# EAGLE design GPS Dog Tracker (EAGLE 7.5.0)
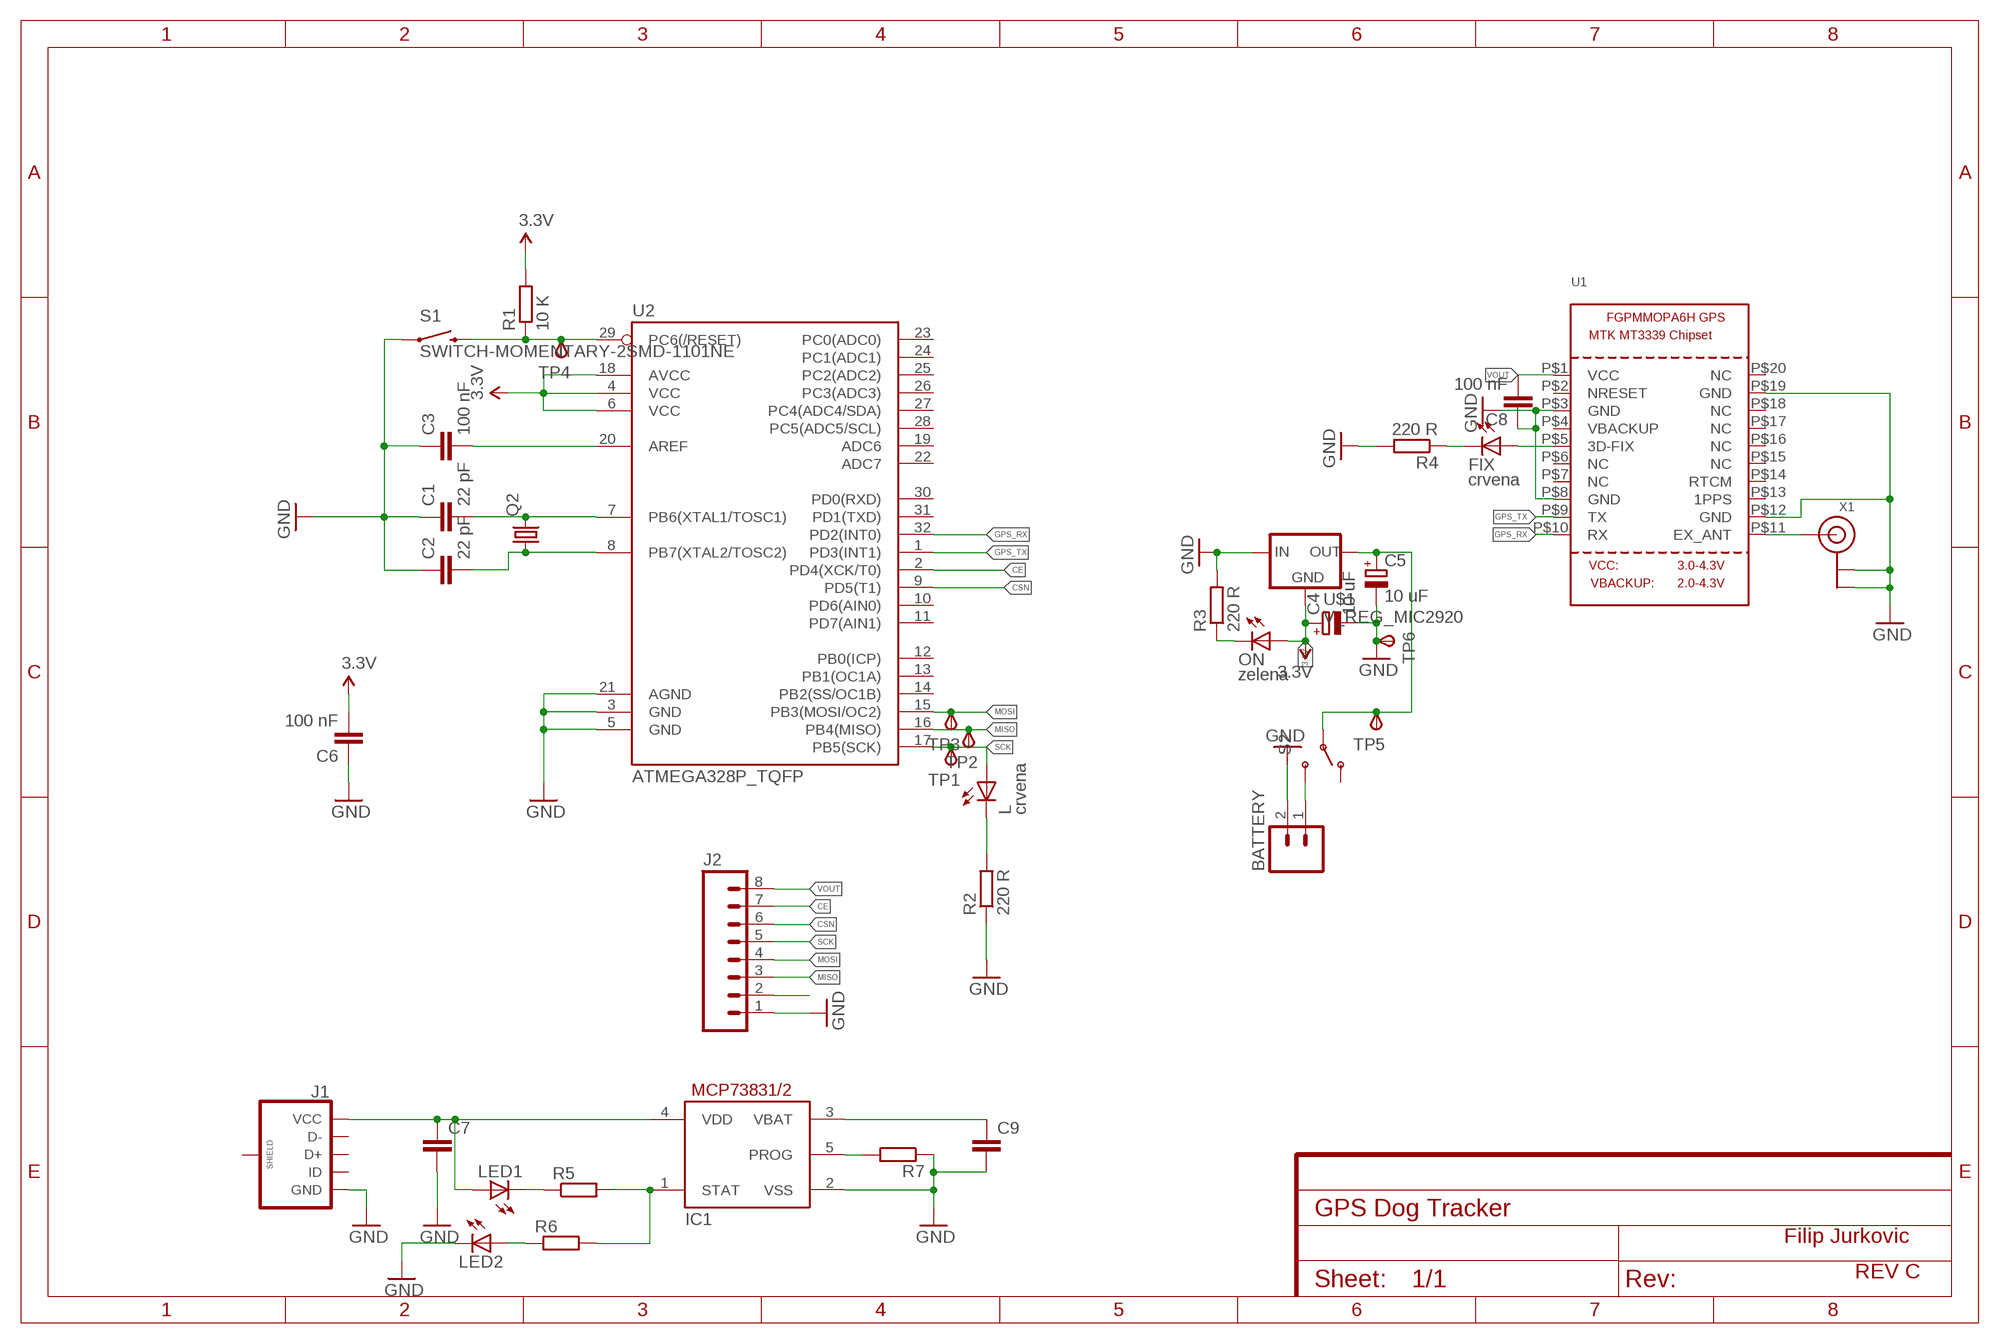
[diagram p0: schematic, sheet 1]

## Parts
BATTERY  M021X02_NO_SILK  [1X02_NO_SILK]
C1  22 pF  C-EUC0603  [C0603]
C2  22 pF  C-EUC0603  [C0603]
C3  100 nF  C-EUC0603  [C0603]
C4  10 uF  CPOL-EUSMCA  [SMC_A]
C5  10 uF  CPOL-EUSMCA  [SMC_A]
C6  100 nF  C-EUC0603  [C0603]
C7  C-EUC0603  [C0603]
C8  100 nF  C-EUC0603  [C0603]
C9  C-EUC0603  [C0603]
FIX  crvena  LEDCHIP-LED0805  [CHIP-LED0805]
IC1  MCP73831/OT  [SOT23-5L]
J1  USB_MICROB_PLUGCONN-11752  [USB-B-MICRO-SMD_V03]
J2  M08SILK_FEMALE_PTH  [1X08]
L  crvena  LEDCHIP-LED0805  [CHIP-LED0805]
LED1  LEDCHIPLED_0805  [CHIPLED_0805]
LED2  LEDCHIPLED_0805  [CHIPLED_0805]
ON  zelena  LEDCHIP-LED0805  [CHIP-LED0805]
Q2  CRYSTALHC49S  [HC49/S]
R1  10 K  R-EU_R0603  [R0603]
R2  220 R  R-EU_R0603  [R0603]
R3  220 R  R-EU_R0603  [R0603]
R4  220 R  R-EU_R0603  [R0603]
R5  R-EU_R0603  [R0603]
R6  R-EU_R0603  [R0603]
R7  R-EU_R0603  [R0603]
S1  SWITCH-MOMENTARY-2SMD-1101NE  [TACTILE-SWITCH-1101NE]
S2  SWITCH-SPDT-SMD-A  [SWITCH-SPST-SMD-A]
TP1  TPSTP13R  [TP13R]
TP2  TPSTP13R  [TP13R]
TP3  TPSTP13R  [TP13R]
TP4  TPSTP13R  [TP13R]
TP5  TPSTP13R  [TP13R]
TP6  TPSTP13R  [TP13R]
U1  GPS_FGPMMOPA6H  [FGPMMOPA6H]
U2  ATMEGA328P_TQFP  [TQFP32-08]
U$1  V_REG_MIC2920  [SOT223]
X1  ANTENNA_U.FL  [U.FL]

## Nets
3.3V: C4.+ C6.2 ON.A R1.2 U2.4(VCC) U2.6(VCC) U2.18(AVCC) U$1.2(GND)
CE: J2.7 U2.2(PD4(XCK/T0))
CSN: J2.6 U2.9(PD5(T1))
GND: BATTERY.2 C1.1 C2.1 C3.1 C4.- C5.- C6.1 C7.2 C8.1 C9.2 IC1.2(VSS) J1.GND J2.1 LED2.C R2.1 R3.2 R4.2 R7.1 S1.1 TP6.TP(PP) U1.P$3(GND) U1.P$8(GND) U1.P$12(GND) U1.P$19(GND) U2.3(GND) U2.5(GND) U2.21(AGND) U$1.1(IN) X1.1(GND) X1.2(GND)
GPS_RX: U1.P$10(RX) U2.32(PD2(INT0))
GPS_TX: U1.P$9(TX) U2.1(PD3(INT1))
MISO: J2.3 TP2.TP(PP) U2.16(PB4(MISO))
MOSI: J2.4 TP3.TP(PP) U2.15(PB3(MOSI/OC2))
N$1: C1.2 Q2.2 U2.7(PB6(XTAL1/TOSC1))
N$2: C2.2 Q2.1 U2.8(PB7(XTAL2/TOSC2))
N$3: C3.2 U2.20(AREF)
N$4: ON.C R3.1
N$5: FIX.A U1.P$5(3D-FIX)
N$6: FIX.C R4.1
N$7: J2.2
N$8: L.C R2.2
N$9: IC1.1(STAT) R5.2 R6.2
N$10: LED1.C R5.1
N$11: LED2.A R6.1
N$12: U1.P$11(EX_ANT) X1.3(SIGNAL)
N$13: IC1.5(PROG) R7.2
RESET: R1.1 S1.2 TP4.TP(PP) U2.29(PC6(/RESET))
SCK: J2.5 L.A TP1.TP(PP) U2.17(PB5(SCK))
VIN: BATTERY.1 C9.1 IC1.3(VBAT) S2.3(S)
VIN1: C5.+ C7.1 IC1.4(VDD) J1.VBUS(VCC) LED1.A S2.2(P) TP5.TP(PP) U$1.3(OUT)
VOUT: C8.2 J2.8 U1.P$1(VCC)
Unconnected: J1.D+ J1.D- J1.ID J1.SHIELD1(SHIELD) J1.SHIELD2(SHIELD) J1.SHIELD3(SHIELD) S2.1(O) U1.P$2(NRESET) U1.P$4(VBACKUP) U1.P$6(NC) U1.P$7(NC) U1.P$13(1PPS) U1.P$14(RTCM) U1.P$15(NC) U1.P$16(NC) U1.P$17(NC) U1.P$18(NC) U1.P$20(NC) U2.10(PD6(AIN0)) U2.11(PD7(AIN1)) U2.12(PB0(ICP)) U2.13(PB1(OC1A)) U2.14(PB2(SS/OC1B)) U2.19(ADC6) U2.22(ADC7) U2.23(PC0(ADC0)) U2.24(PC1(ADC1)) U2.25(PC2(ADC2)) U2.26(PC3(ADC3)) U2.27(PC4(ADC4/SDA)) U2.28(PC5(ADC5/SCL)) U2.30(PD0(RXD)) U2.31(PD1(TXD))

## Notes on the sheet
- Filip Jurkovic
- REV C

## Library data of the parts
BATTERY = SparkFun-Connectors:M02: Standard 2-pin 0.1" header. Use with - straight break away headers ( PRT-00116) - right angle break away headers (PRT-00553) - swiss pins (PRT-00743) - machine pins (PRT-00117) - female headers (PRT-00115) Molex polarized connector foot print use with: PRT-08233 with associated crimp pins and housings. 2.54_SCREWTERM for use with PRT-10571. 3.5mm Screw Terminal footprints for PRT-08084 5mm Screw Terminal footprints for use with PRT-08432
C1-C3 C6 C8 = rcl:C-EU: CAPACITOR, European symbol
C4 C5 = resistor:CPOL-EU: POLARIZED CAPACITOR, European symbol
C7 C9 = resistor:C-EU: CAPACITOR, European symbol
FIX L LED1 LED2 ON = adafruit:LED: LED OSRAM: - CHIPLED LG R971, LG N971, LY N971, LG Q971, LY Q971, LO R971, LY R971 LH N974, LH R974 LS Q976, LO Q976, LY Q976 LO Q996 - Hyper CHIPLED LW Q18S LB Q993, LB Q99A, LB R99A - SideLED LS A670, LO A670, LY A670, LG A670, LP A670 LB A673, LV A673, LT A673, LW A673 LH A674 LY A675 LS A676, LA A676, LO A676, LY A676, LW A676 LS A679, LY A679, LG A679 - Hyper Micro SIDELED® LS Y876, LA Y876, LO Y876, LY Y876 LT Y87S - SmartLED LW L88C, LW L88S LB L89C, LB L89S, LG L890 LS L89K, LO L89K, LY L89K LS L896, LA L896, LO L896, LY L896 - TOPLED LS T670, LO T670, LY T670, LG T670, LP T670 LSG T670, LSP T670, LSY T670, LOP T670, LYG T670 LG T671, LOG T671, LSG T671 LB T673, LV T673, LT T673, LW T673 LH T674 LS T676, LA T676, LO T676, LY T676, LB T676, LH T676, LSB T676, LW T676 LB T67C, LV T67C, LT T67C, LS T67K, LO T67K, LY T67K, LW E67C LS E67B, LA E67B, LO E67B, LY E67B, LB E67C, LV E67C, LT E67C LW T67C LS T679, LY T679, LG T679 LS T770, LO T770, LY T770, LG T770, LP T770 LB T773, LV T773, LT T773, LW T773 LH T774 LS E675, LA E675, LY E675, LS T675 LS T776, LA T776, LO T776, LY T776, LB T776 LHGB T686 LT T68C, LB T68C - Hyper Mini TOPLED® LB M676 - Mini TOPLED Santana® LG M470 LS M47K, LO M47K, LY M47K Source: http://www.osram.convergy.de/
IC1 = adafruit:MCP73831: MCP73831/2 Miniature Single-Cell, Fully Integrated Li-Ion, Li-Polymer Charge Management Controllers. Nice and small simple lipoly charge controller, with adjustable current and status output (LED) http://www.ladyada.net/library/pcb/eaglelibrary.html
J1 = SparkFun-Connectors:USB_MICROB_PLUG: USB Micro-B connectors Some male, some female. Watch your step!; PROD_ID: CONN-11752
J2 = SparkFun-Connectors:M08: Header 8 Standard 8-pin 0.1" header. Use with straight break away headers (SKU : PRT-00116), right angle break away headers (PRT-00553), swiss pins (PRT-00743), machine pins (PRT-00117), and female headers (PRT-00115).; PROD_ID: CONN-08438
Q2 = adafruit:CRYSTAL: CRYSTAL; OC_FARNELL: 1667008; OC_NEWARK: unknown
R1-R7 = rcl:R-EU_: RESISTOR, European symbol
S1 = SparkFun-Electromechanical:SWITCH-MOMENTARY-2: Various NO switches- pushbuttons, reed, etc; PROD_ID: SWCH-00815
S2 = SparkFun-Electromechanical:SWITCH-SPDT: SPDT Switch Simple slide switch, Spark Fun Electronics SKU : COM-00102 DPDT SMT slide switch, AYZ0202, SWCH-08179; PROD_ID: SWCH-10651
TP1-TP6 = testpad:TPS: TEST PIN
U1 = adafruit:GPS_FGPMMOPA6H: GPS Module - MTK MT3339 Chipset, -165dBm sensitivity, 22 channels, 10Hz, auto-select external antenna options
U2 = SparkFun-DigitalIC:ATMEGA328P_TQFP; PROD_ID: IC-09069
U$1 = SparkFun-PowerIC:V_REG_MIC2920: MIC2920A (http://www.micrel.com/_PDF/mic2920.pdf) - 400mA output LDO Regulator
X1 = adafruit:ANTENNA_U.FL: U.FL Antenna Connector

## Board
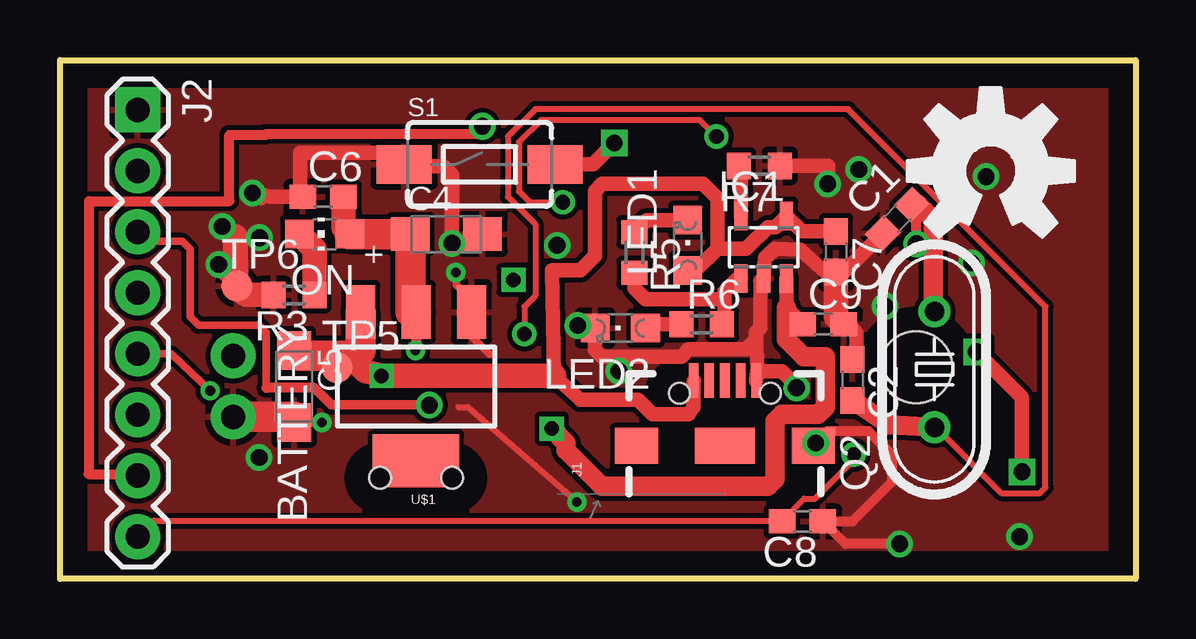
[diagram p1: board, top side]
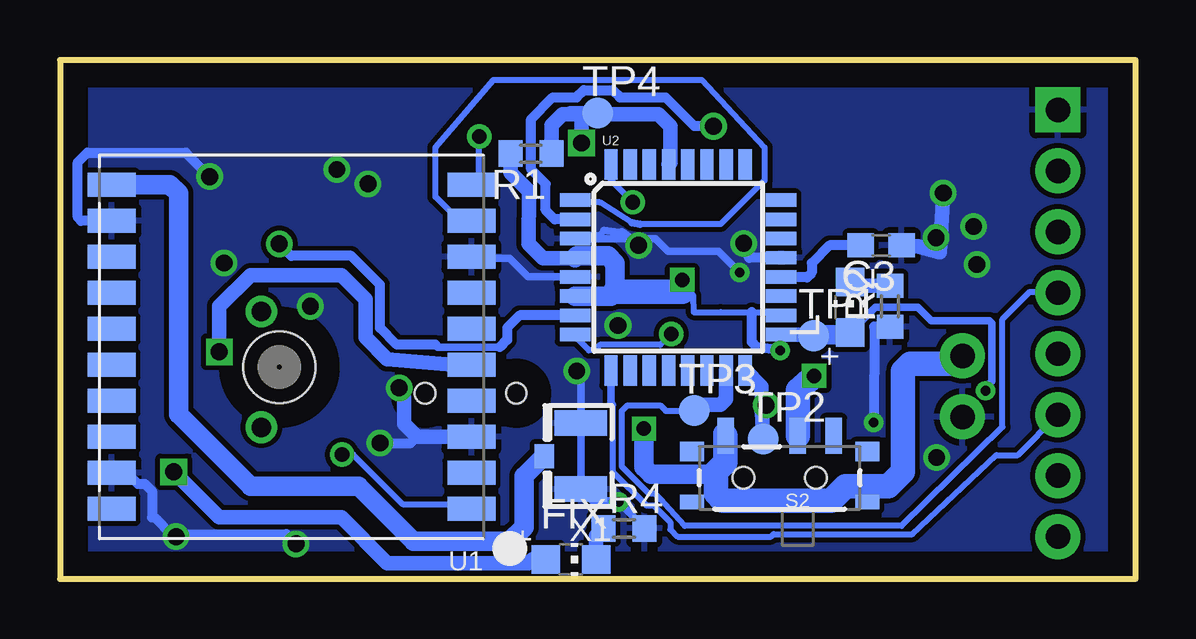
[diagram p2: board, bottom side, seen from below]

Size 44.84 x 21.62 mm. Coordinates in mm from the lower left corner, seen from the top.
Outline: 0,21.62 44.84,21.62 44.84,0 0,0 0,21.62
Copper layers (1*16): Top 0.035mm / dielectric 1.5mm / Bottom 0.035mm
Design rules "default": minimum track width 10mil, minimum drill 24mil, track to track 8mil, track to pad 8mil, pad to pad 8mil, via to via 8mil, smd to smd 8mil, copper to edge 40mil, drill to drill 8mil, minimum pad ring 10mil, minimum via ring 8mil, stop-mask expansion 4mil, vias tented up to drill 0mil, thermal gap 10mil

### Footprints (pad centres in the part's own frame; a part is rotated, then mirrored left to right if it is on the bottom)
1X02_NO_SILK = drill 1.016 pad 1.88: 1 0,0; 2 2.54,0
C0603 = smd 1.1 x 1: 1 -0.85,0; 2 0.85,0
SMC_A = smd 1.6 x 1.4: + -1.5,0; - 1.5,0
CHIP-LED0805 = smd 1.2 x 1.2: A 0,-1.05; C 0,1.05
SOT23-5L = smd 0.55 x 1.2: 1 -0.95,-1.3; 2 0,-1.3; 3 0.95,-1.3; 4 0.95,1.3; 5 -0.95,1.3
USB-B-MICRO-SMD_V03 = smd 1.45 x 0.4: D+ 2.725,0; D- 2.725,0.65; GND 2.725,-1.3; ID 2.725,-0.65; VBUS 2.725,1.3 | smd 1.5 x 1.8: SHIELD1 0,3.685; SHIELD2 0,-3.685 | smd 1.5 x 2.5: SHIELD3 0,0 | hole 0.85: 2.2,1.9; 2.2,-1.9
1X08 = drill 1.016 pad 1.88 square: 1 0,0 | drill 1.016 pad 1.88: 2 2.54,0; 3 5.08,0; 4 7.62,0; 5 10.16,0; 6 12.7,0; 7 15.24,0; 8 17.78,0
CHIPLED_0805 = smd 1.2 x 1.2: A 0,-1.05; C 0,1.05
HC49/S = drill 0.813: 1 -2.413,0; 2 2.413,0
R0603 = smd 1 x 1.1: 1 -0.85,0; 2 0.85,0
TACTILE-SWITCH-1101NE = smd 2.3 x 1.6: 1 -3.15,0; 2 3.15,0
SWITCH-SPST-SMD-A = smd 0.7 x 1.5: 1 -2.25,-1.75; 2 -0.75,-1.75; 3 2.25,-1.75 | smd 1 x 0.6: GND1 -3.65,1; GND3 3.65,1 | smd 1 x 0.8: GND2 -3.65,-1.1; GND4 3.65,-1.1 | hole 0.9: -1.5,0; 1.5,0
TP13R = smd 1.3 x 1.3: TP 0,0
FGPMMOPA6H = smd 2 x 1: P$1 -7.5,6.75; P$2 -7.5,5.25; P$3 -7.5,3.75; P$4 -7.5,2.25; P$5 -7.5,0.75; P$6 -7.5,-0.75; P$7 -7.5,-2.25; P$8 -7.5,-3.75; P$9 -7.5,-5.25; P$10 -7.5,-6.75; P$11 7.5,-6.75; P$12 7.5,-5.25; P$13 7.5,-3.75; P$14 7.5,-2.25; P$15 7.5,-0.75; P$16 7.5,0.75; P$17 7.5,2.25; P$18 7.5,3.75; P$19 7.5,5.25; P$20 7.5,6.75 | hole 3: 0.5,0.85
TQFP32-08 = smd 1.27 x 0.559: 1 -4.293,2.8; 2 -4.293,2; 3 -4.293,1.2; 4 -4.293,0.4; 5 -4.293,-0.4; 6 -4.293,-1.2; 7 -4.293,-2; 8 -4.293,-2.8; 17 4.293,-2.8; 18 4.293,-2; 19 4.293,-1.2; 20 4.293,-0.4; 21 4.293,0.4; 22 4.293,1.2; 23 4.293,2; 24 4.293,2.8 | smd 0.559 x 1.27: 9 -2.8,-4.293; 10 -2,-4.293; 11 -1.2,-4.293; 12 -0.4,-4.293; 13 0.4,-4.293; 14 1.2,-4.293; 15 2,-4.293; 16 2.8,-4.293; 25 2.8,4.293; 26 2,4.293; 27 1.2,4.293; 28 0.4,4.293; 29 -0.4,4.293; 30 -1.2,4.293; 31 -2,4.293; 32 -2.8,4.293
SOT223 = smd 1.219 x 2.235: 1 -2.311,-3.099; 2 0,-3.099; 3 2.311,-3.099 | smd 3.6 x 2.2: 4 0,3.099
U.FL = smd 2.2 x 1.05: 1 0,1.375; 2 0,-1.375 | smd 0.8 x 1: 3 1.525,0

### Placement (x,y rotation side)
BATTERY  7.22,9.29 270 top
C1  34.9,15 45 top
C2  33.04,8.29 270 top
C3  10.61,13.9 180 bottom
C4  16.11,14.37 0 top
C5  9.76,8.02 270 top
C6  10.97,15.92 0 top
C7  32.35,13.63 270 top
C8  30.95,2.4 180 top
C9  31.82,10.61 0 top
FIX  23.54,0.81 270 bottom
IC1  29.33,13.82 0 top
J1  27.72,5.54 90 top
J2  3.24,19.54 270 top
L  11.9,11.32 0 bottom
LED1  26.17,13.9 0 top
LED2  23.36,10.45 90 top
ON  11.03,14.37 90 top
Q2  36.45,8.73 90 top
R1  25.21,17.72 180 bottom
R2  10.24,11.36 90 bottom
R3  9.76,11.83 180 top
R4  21.33,2.1 0 bottom
R5  23.95,13.6 270 top
R6  26.75,10.61 0 top
R7  29.16,17.21 180 top
S1  17.49,17.27 0 top
S2  14.84,4.21 180 bottom
TP1  13.42,10.13 0 bottom
TP2  15.53,5.83 0 bottom
TP3  18.41,7.01 0 bottom
TP4  22.43,19.41 0 bottom
TP5  11.55,8.81 0 top
TP6  7.37,12.21 0 top
U1  35.19,9.67 180 bottom
U2  19.07,12.98 0 bottom
U$1  14.84,8.02 180 top
U$2  [OSHW-LOGO-L]  38.8,17 0 top
X1  23.13,5.12 180 bottom

### Tracks (layer width: path | path; a pad name or v marks a point on that pad's centre or on a via)
3.3V  (via drill 0.4, 0.6)
  Top 0.406: U$1.2 14.84,9.7 v14.82,9.52
  Top 1.016: C6.2 11.82,14.63 ON.A
  Top 1.27: ON.A C4.+ 14.61,11.12 U$1.2
  Bottom 0.254: U2.18 14.79,11.12 16,11.12 17.3,11.12 18.43,11.11 18.45,11.8 18.9,11.96
  Bottom 0.406: v14.82,9.52 15.8,9.66 16,9.86 16,11.12
  Bottom 0.61: R1.2 26.06,16.92 25.28,16.16 25.3,13.96 24.7,13.36 23.38,13.36 U2.4
  Bottom 0.813: U2.6 21.88,11.78 21.7,11.96 21.7,13.16 22,13.46 23.28,13.46 U2.4
  Bottom 1.016: 21.7,11.96 18.9,11.96 v18.9,12.46
CE  (via drill 0.7)
  Top 0.406: 17.4,18.66 v17.6,18.86 17.6,18.54 8.58,18.54 8.58,18.5 7.06,18.5 7.06,15.74 1.2,15.74 1.2,11.48 1.19,4.36 3.24,4.36 J2.7
  Bottom 0.406: U2.2 24.22,14.98 24.6,15.36 24.6,16.46 25.2,17.06 25.2,19.16 24.3,20.06 23.3,20.06 23,20.36 21.8,20.36 21.5,20.06 19.6,20.06 18.4,18.86 v17.6,18.86
CSN
  Bottom 0.254: 21.8,7.26 21.8,4.46 20.4,3.06 20.1,3.06 19.4,2.36 19.4,2.06 19.1,1.76 15.2,1.76 15.1,1.86 9.3,1.86 5.8,5.16 4.92,5.16 J2.6
  Bottom 0.305: U2.9 21.87,7.33 21.8,7.26
GND  (via drill 0.4, 0.7)
  Top 0.254: 16.6,7.16 17,7.16 v21.55,3.21
  Top 0.305: v23.3,8.66 23.3,9.16 23.2,9.26 | v16.5,12.76 16.5,12.26 17,11.76 17,10.26 17.9,9.36
  Top 0.406: v16.34,13.98 17,13.76 C4.- | v31.5,5.66 32,6.16 33.7,6.16 34.7,5.16 34.7,4.06 33.04,2.4 C8.1 32.74,1.46 v35,1.46 | LED2.C 21.61,10.45 v21.58,10.56 | 8.4,15.76 v8.02,16.08 | v10.92,6.52 9.76,6.5 C5.-
  Top 0.61: J1.GND 29.08,8.78 | 29.08,8.78 29.02,9.98 | 29.02,9.98 29.02,10.28 29.2,10.46 29.2,12.39 IC1.2 29.38,13.37 29.5,13.46 29.8,13.76 30.86,13.72 31.94,12.74 C7.2 32.68,12.78 C1.1 | 29.02,9.98 28.6,9.56 26.2,9.56 25.9,9.26 23.2,9.26 22.6,9.26 22.31,9.55 LED2.C | C9.2 32.85,10.61 33.2,10.26 33.2,9.3 C2.1 | v30.7,7.96 30.7,8.06 30.1,8.66 29.12,8.66 29.08,8.78 | v8.02,16.08 8.76,15.92 C6.1 10,15.92 10,17.76 14.34,17.76 S1.1 14.41,17.2 15.98,17.2 16.34,16.84 v16.34,13.98 | R7.1 32,17.21 v32,16.46 | 17,11.76 17,11.27 U$1.1 | v6.62,13.1 6.62,12.96 TP6.TP
  Top 1.016: C7.2 32.35,10.93 C9.2 | R3.2 7.73,11.83 7.3,12.26 7.3,14.28 TP6.TP
  Top 1.27: BATTERY.2 9.76,6.75 C5.-
  Bottom 0.254: U2.3 23.25,14.32 22.33,14.32 22.17,14.53 | v21.55,3.21 21.05,2.67 R4.2
  Bottom 0.305: R4.2 20.98,2.64 v21.55,3.21 21.2,3.26 22.64,3.26 X1.1 X1.2 23.13,8.49 v23.3,8.66 | 21.41,14.41 22.17,14.53 | U2.3 20.02,14.18 19.5,13.66 17.4,13.66 v16.5,12.76 | U2.5 25.32,12.58 26.1,13.36 27.63,13.36 U1.P$8
  Bottom 0.406: U2.21 16.12,13.38 v16.34,13.98 | v31.5,5.66 30.22,5.66 29.96,5.92 | 21.41,14.41 v20.72,13.9 | U1.P$19 42.06,4.42 41.6,3.96 41.3,3.96 41,3.66 41,2.56 40.9,2.56 40.2,1.86 35.4,1.86 v35,1.46 | U1.P$12 43.96,14.92 44.1,15.06 44.1,17.36 43.7,17.76 39.6,17.76 v38.6,16.76 | R2.1 10.9,10.51 v10.92,6.52
  Bottom 0.61: U1.P$3 29.96,5.92 30.5,6.46 30.5,7.56 v30.7,7.96 | v8.02,16.08 8.16,13.62 9.1,13.86 9.72,13.86 C3.1
  other vias: 8.3,5.06 33.3,17.06 38,13.16 34.4,11.36 6.76,14.68 8.32,14.22 40,1.76
  pour Bottom: 0.08,21.92 7.74,21.38 7.9,21.54 15.66,21.54 15.78,21.64 44.84,21.64 44.84,-0.02 5.98,-0.02 0.08,-0.06
  pour Top: 0,3.98 0,21.62 44.84,21.62 44.84,0 -0.02,0
GPS_RX  (via drill 0.61)
  Top 0.254: v20.96,15.69 19.59,15.69 19.13,16.15 19.13,18.2 20.05,19.12 26.68,19.12 v27.36,18.43
  Bottom 0.254: v20.96,15.69 21.88,16.61 21.88,17.06 U2.32 | v27.36,18.43 27.36,16.83 27.59,16.61 U1.P$10
GPS_TX
  Bottom 0.254: 20.99,14.85 22.33,15.69 23.25,15.69 U2.1 | 20.66,14.78 17.3,14.78 15.47,16.61 15.47,17.98 18.09,20.79 26.78,20.79 29.19,17.98 29.19,15.92 28.28,15 27.82,15 U1.P$9
  Bottom 0.305: 20.66,14.78 20.99,14.85
MISO  (via drill 0.7)
  Top 0.305: 8.6,7.96 8.6,10.26 8.3,10.56 5.78,10.56 5.42,10.92 5.42,13.74 5.1,14.06 3.64,14.06 J2.3
  Top 0.406: v15.4,7.24 11.3,7.26 10.6,7.96 8.6,7.96
  Bottom 0.406: TP2.TP 15.73,7.33 v15.4,7.24
  Bottom 0.61: TP2.TP 15.59,8.01 U2.16
MOSI
  Bottom 0.254: TP3.TP 18.67,7 19.59,7 19.82,7.23 21.19,7.23 21.42,7 21.42,4.68 20.3,3.56 20.06,3.56 19.82,3.32 18.8,2.2 9.76,2.2 5.55,6.33 5.55,10.83 4.42,11.96 3.28,11.96 J2.4
  Bottom 0.61: U2.15 17.07,7.49 17.3,7.26 18.16,7.26 TP3.TP
N$1  (via drill 0.7)
  Top 0.406: v35.7,13.96 35.7,14.96 36.05,15.31
  Top 0.813: C1.2 35.76,15.6 36.05,15.31 36.4,14.96 36.4,11.19 Q2.2
  Bottom 0.305: 26.5,9.66 29.1,9.66 29.2,9.76
  Bottom 0.406: U2.7 25.68,10.98 26.2,10.46 26.2,9.96 26.5,9.66 | 29.2,9.76 30.8,9.76 31.5,10.46 31.5,12.26 32.7,13.46 35.2,13.46 v35.7,13.96
N$2  (via drill 0.61)
  Top 0.254: v19.36,10.2 19.36,11.35 19.82,11.8 19.82,14.78 18.67,15.92 18.67,18.43 19.82,19.58 32.85,19.58 41.08,11.35 41.08,3.8 40.85,3.57 39.25,3.57 36.73,6.09 Q2.1
  Top 0.813: Q2.1 34.56,6.42 C2.2
  Bottom 0.254: v19.36,10.2 19.82,9.75 22.33,9.75 22.56,9.52 22.79,9.52 23.25,9.98 U2.8
N$3
  Bottom 0.406: C3.2 12.76,13.9 13.5,13.16 13.5,12.76 13.7,12.56 14.76,12.56 U2.20
N$4
  Top 1.016: R3.1 10.61,13.74 ON.C
N$5  (via drill 0.7)
  Top 0.61: v40.1,4.46 40.1,7.56 v38.2,9.46
  Bottom 0.61: FIX.A 25.15,0.81 25.3,0.66 31.2,0.66 33.1,2.56 38.2,2.56 v40.1,4.46 | v38.2,9.46 38.2,11.36 36.9,12.66 33.1,12.66 32.1,11.66 32.1,10.06 31.2,9.16 27.75,8.86 U1.P$5
N$6
  Bottom 0.61: FIX.C 22.49,1.79 R4.1
N$8
  Bottom 0.61: R2.2 11.94,12.21 L.C
N$9
  Top 0.61: IC1.1 28.26,12.52 27.7,11.96 27.7,11.66 | 27.7,11.66 27.7,10.71 R6.2 | R5.2 23.95,12.11 24.4,11.66 27.7,11.66
N$10
  Top 0.61: LED1.C 24.45,14.95 R5.1
N$11
  Top 0.61: R6.1 24.57,10.61 LED2.A
N$12
  Bottom 0.813: U1.P$11 40.26,16.42 39.9,16.06 39.9,6.86 36.9,3.86 32.4,3.86 30.1,1.56 26.1,1.56 25.5,2.16 25.5,4.28 X1.3
N$13
  Top 0.61: IC1.5 28.38,17.14 R7.2
RESET  (via drill 0.7)
  Top 0.61: S1.2 22.21,17.27 v23.1,18.16
  Bottom 0.61: R1.1 24.36,18.9 23.9,19.36 23.6,19.36 | 23.6,19.36 23.1,19.36 | 23.1,19.36 19.9,19.36 19.4,18.86 19.4,17.34 U2.29 | TP4.TP 23.55,19.41 23.6,19.36 | v23.1,18.16 23.1,19.36
SCK  (via drill 0.4)
  Top 0.305: J2.5 4.64,9.38 v6.26,7.84
  Bottom 0.305: v6.26,7.84 6.08,8.16 6,8.24 6,10.66 6.1,10.76 8.52,10.76 9.08,11.32 10.85,11.32 L.A
  Bottom 0.61: U2.17 12.19,10.18 L.A
  Bottom 0.813: 12.19,10.18 13.37,10.18 TP1.TP
VIN  (via drill 0.6)
  Top 0.61: IC1.3 30.28,11.3 C9.1
  Top 0.813: 30.28,11.3 30.28,9.98 31,9.26 31.9,9.26 31.9,7.16 31.6,6.86 30.1,6.86 29.8,6.56 29.8,4.16 29.5,3.86 22.6,3.86 21.1,5.36 21.1,5.66 v20.5,6.26
  Bottom 0.813: 17.2,6.07 S2.3 | v20.5,6.26 20.5,4.66 20.2,4.36 17.6,4.36 17.5,4.26
  Bottom 1.016: S2.3 17.09,4.87 17.5,4.46 17.5,4.26 17.5,3.56 17.2,3.26 12.7,3.26 12.1,3.86 10.3,3.86 9.7,4.46 9.7,8.66 9.4,8.96 7.55,8.96 BATTERY.1
VIN1  (via drill 0.6)
  Top 0.61: C7.1 30.92,14.48 IC1.4 29.82,14.66 29.5,14.66 28.6,13.76 27.4,13.76 | LED1.A 26.49,12.85 27.4,13.76 | 27.4,13.76 27.4,15.86 26.8,16.46 22.6,16.46 22.3,16.16 22.3,13.46 21.7,12.86 20.5,12.86 20.6,8.46 21.7,7.46 24.1,7.46 24.7,6.86 26.2,6.86 26.4,7.16 26.4,8.18 J1.VBUS | TP5.TP 11.62,8.81 12.1,9.29
  Top 1.016: 20.6,8.46 v13.4,8.46 12.73,8.66 12.1,9.29
  Top 1.27: U$1.3 12.53,9.52 12.3,9.29 12.1,9.29 9.99,9.29 C5.+
  Bottom 1.016: S2.2 14.09,7.87 v13.4,8.46
VOUT  (via drill 0.61)
  Top 0.254: v33.08,5.18 33.08,4.95 31.48,3.35 31.02,3.35 30.1,2.43 C8.2 29.88,2.43 3.91,2.43 J2.8
  Bottom 0.254: v33.08,5.18 32.62,5.18 30.56,3.12 27.82,3.12 U1.P$1

### Text on the board
Unrouted: Battery charger | + | + | nRF24L01 | 3.3V power